# EAGLE design lcduino (EAGLE 6.1)
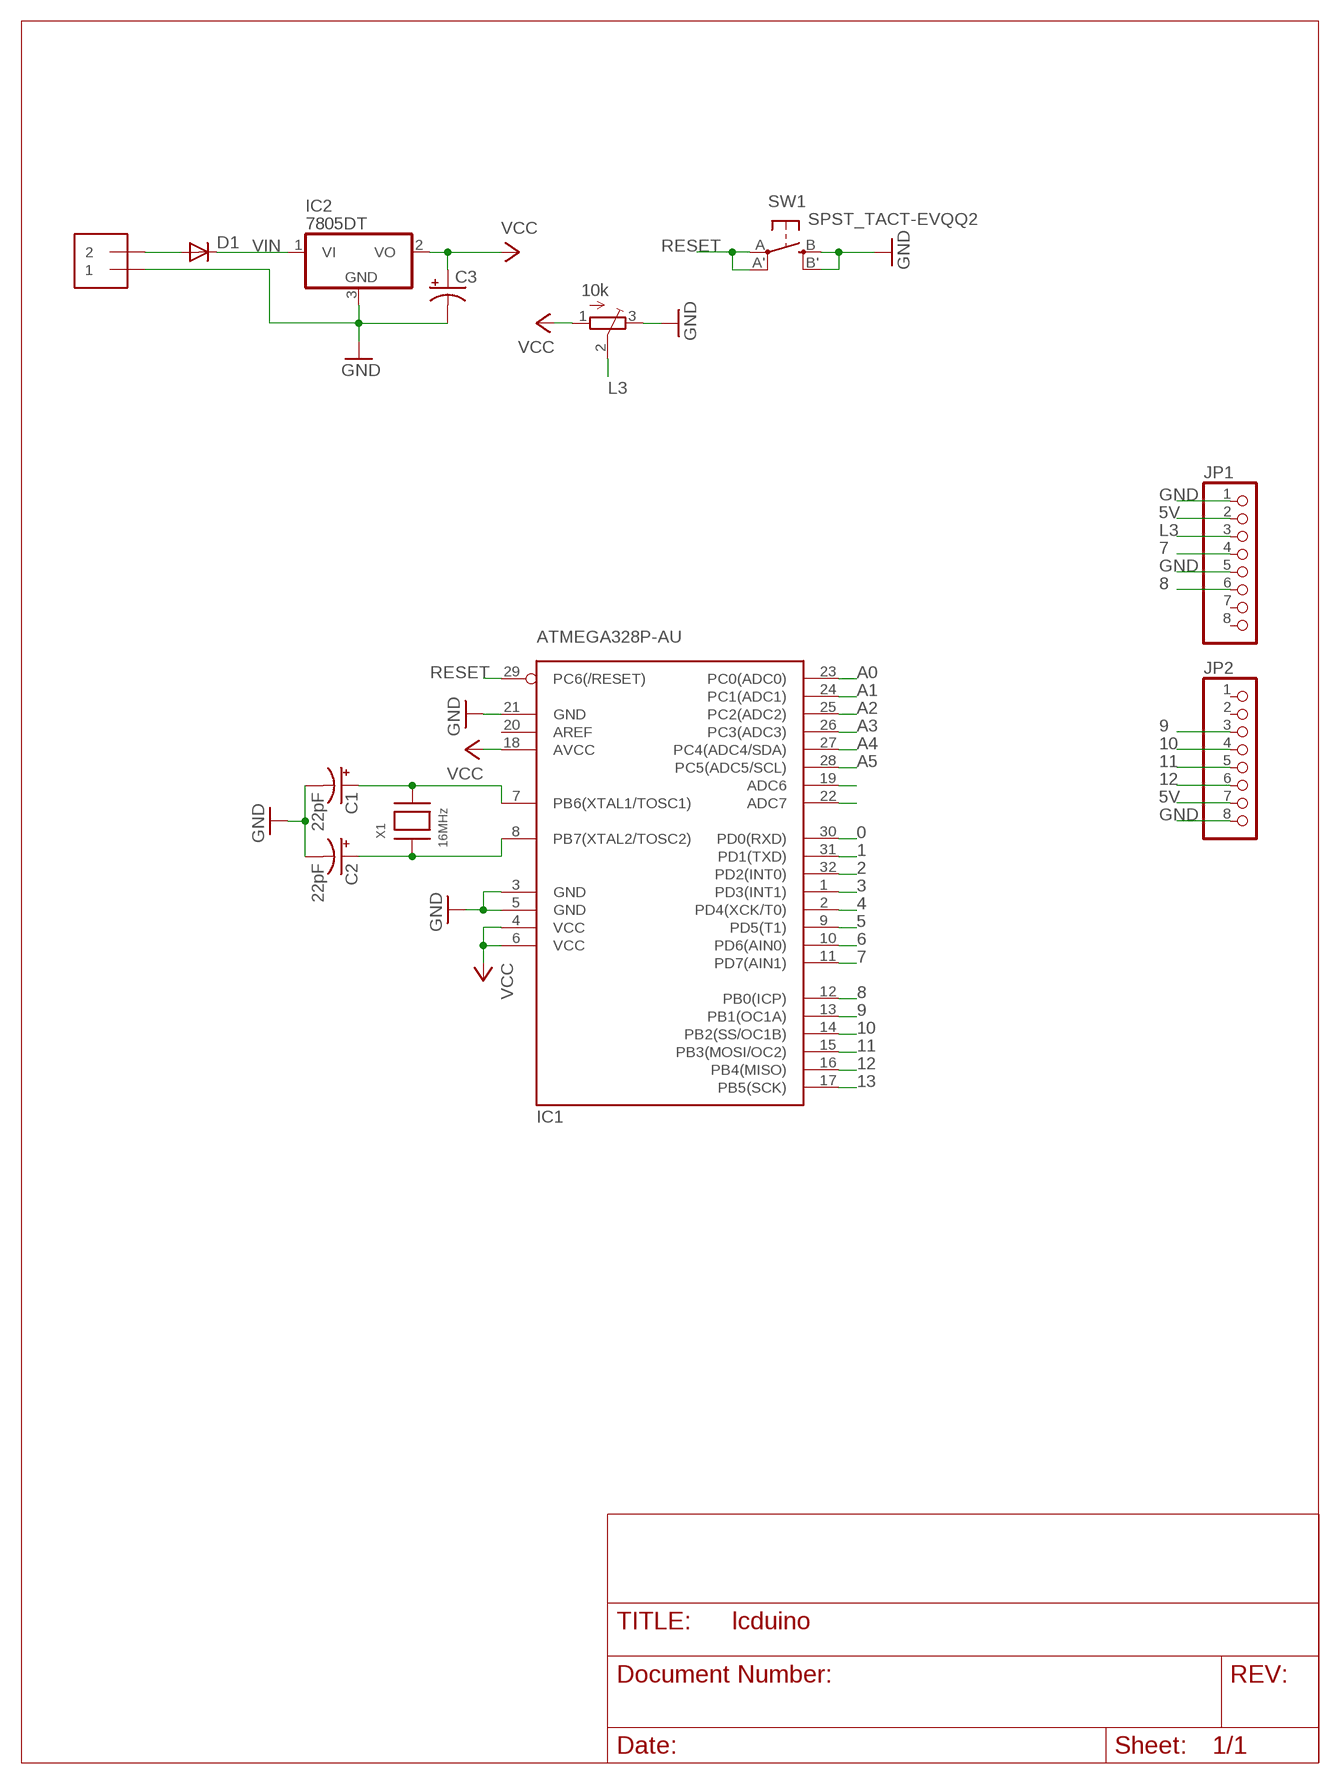
[diagram p0: schematic, sheet 1]

## Parts
C1  22pF  CPOL-US085CS-1AR  [085CS_1AR]
C2  22pF  CPOL-US085CS-1AR  [085CS_1AR]
C3  CPOL-US085CS-1AR  [085CS_1AR]
D1  DIODE-SOD106-R  [SOD106-R]
IC1  MEGA8-AI  [TQFP32-08]
IC2  7805DT  [TO252]
J1  1X2-3.5MM  [1X2-3.5MM]
JP1  PINHD-1X8CLEANBIG  [1X08-CLEANBIG]
JP2  PINHD-1X8CLEANBIG  [1X08-CLEANBIG]
SW1  SPST_TACT-EVQQ2  [EVQ-Q2]
U$1  10k  TRIMPOTTC33X  [TC33X]
X1  16MHz  XTALNX8045  [NX8045]

## Nets
0: IC1.30(PD0(RXD))
1: IC1.31(PD1(TXD))
2: IC1.32(PD2(INT0))
3: IC1.1(PD3(INT1))
4: IC1.2(PD4(XCK/T0))
5: IC1.9(PD5(T1))
5V: C3.+ IC1.4(VCC) IC1.6(VCC) IC1.18(AVCC) IC2.2(VO) JP1.2 JP2.7 U$1.1(A) ; supply symbol labelled VCC
6: IC1.10(PD6(AIN0))
7: IC1.11(PD7(AIN1)) JP1.4
8: IC1.12(PB0(ICP)) JP1.6
9: IC1.13(PB1(OC1A)) JP2.3
10: IC1.14(PB2(SS/OC1B)) JP2.4
11: IC1.15(PB3(MOSI/OC2)) JP2.5
12: IC1.16(PB4(MISO)) JP2.6
13: IC1.17(PB5(SCK))
A0: IC1.23(PC0(ADC0))
A1: IC1.24(PC1(ADC1))
A2: IC1.25(PC2(ADC2))
A3: IC1.26(PC3(ADC3))
A4: IC1.27(PC4(ADC4/SDA))
A5: IC1.28(PC5(ADC5/SCL))
GND: C1.- C2.- C3.- IC1.3(GND) IC1.5(GND) IC1.21(GND) IC2.3(GND) J1.1 JP1.1 JP1.5 JP2.8 SW1.B'(S1) SW1.B(S) U$1.3(E)
L3: JP1.3 U$1.2(S)
N$9: IC1.19(ADC6)
N$10: IC1.22(ADC7)
PWRIN: D1.A J1.2
RESET: IC1.29(PC6(/RESET)) SW1.A'(P1) SW1.A(P)
VIN: D1.C IC2.1(VI)
XTAL1: C1.+ IC1.7(PB6(XTAL1/TOSC1)) X1.P$2
XTAL2: C2.+ IC1.8(PB7(XTAL2/TOSC2)) X1.P$1
Unconnected: IC1.20(AREF) JP1.7 JP1.8 JP2.1 JP2.2

## Library data of the parts
C1-C3 = rcl:CPOL-US: POLARIZED CAPACITOR, American symbol
D1 = diode:DIODE-: DIODE
IC1 = atmel:MEGA8: MICROCONTROLLER 8 Kbytes FLASH, 1 kbytes SRAM, 512 bytes EEPROM, USART, 6-channel 10 bit ADC, 2-channel 8 bit ADC Pin compatible with Atmega48, ATMega88, ATMega168 Source: avr.lbr; MF: Atmel; MPN: ATMEGA328P-AU; OC_FARNELL: 1715486; OC_NEWARK: 68T2935
IC2 = linear:78*: Positive VOLTAGE REGULATOR Source: http://cache.national.com/ds/LM/LM78L05.pdf http://www.fairchildsemi.com/ds/LM/LM7805.pdf
J1 = adafruit:1X2: 3.5mm Terminal block http://www.ladyada.net/library/pcb/eaglelibrary.html
JP1 JP2 = adafruit:PINHD-1X8: PIN HEADER
SW1 = adafruit:SPST_TACT: SMT 6mm switch, EVQQ2 series http://www.ladyada.net/library/eagle
U$1 = adafruit:TRIMPOT: SMT trimmer potentiometer part number TC33X http://www.ladyada.net/library/eagle
X1 = adafruit:XTAL: Low cost SMT crystals, no capacitors included http://www.ladyada.net/library/eagle

## Board
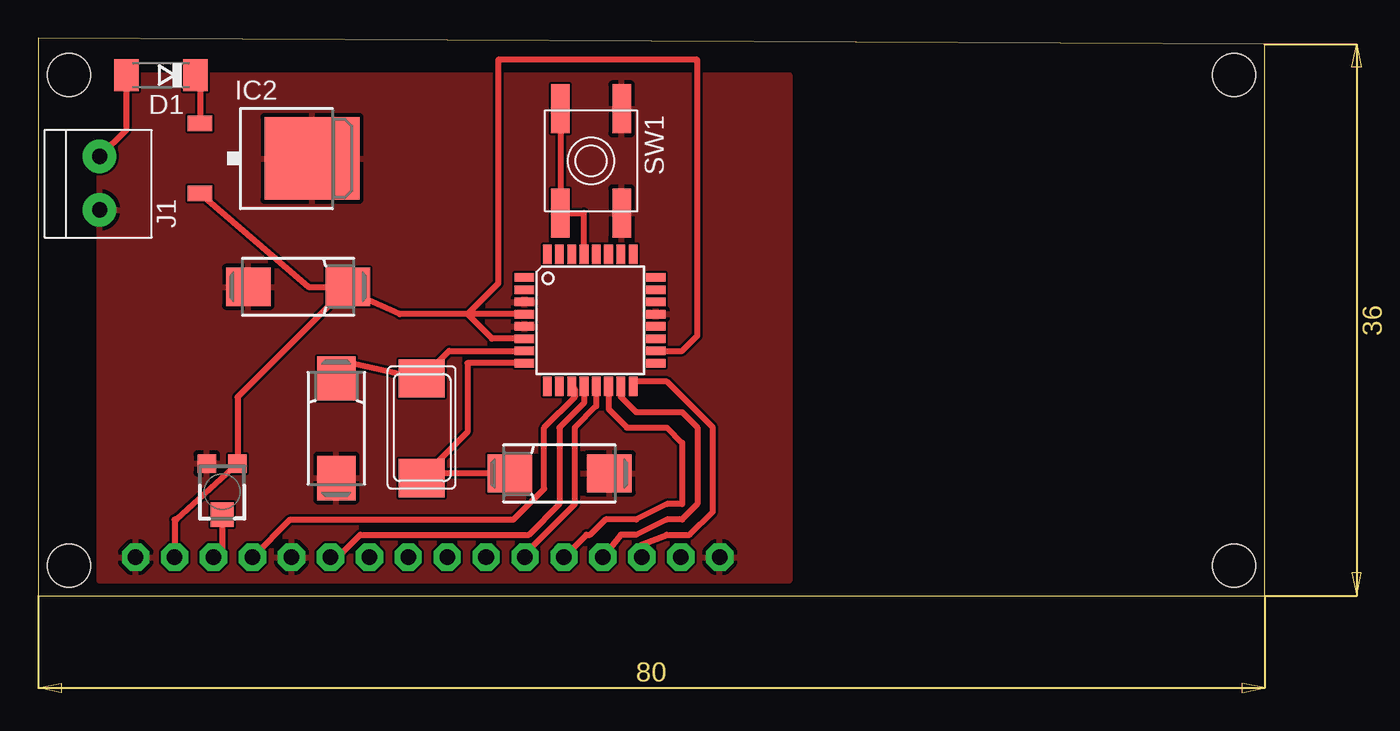
[diagram p1: board, top side]
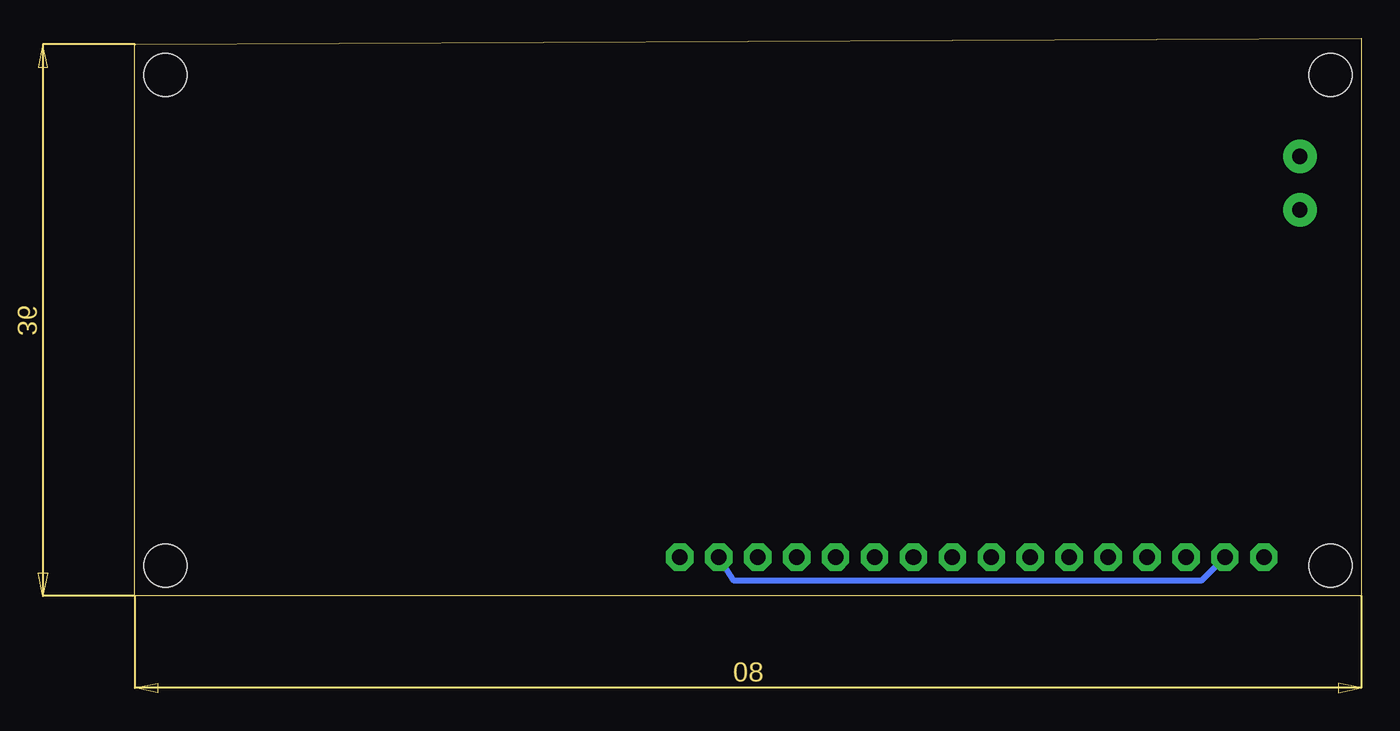
[diagram p2: board, bottom side, seen from below]

Size 80 x 36.4 mm. Coordinates in mm from the lower left corner, seen from the top.
Outline: 0,0 80,0 80,36 0,36.4 0,0
Copper layers (1*16): Top 0.0356mm / dielectric 1.5011mm / Bottom 0.0356mm
Design rules: minimum track width 6mil, minimum drill 13mil, track to track 6mil, track to pad 6mil, pad to pad 6mil, via to via 6mil, smd to smd 6mil, copper to edge 15mil, drill to drill 6mil, minimum pad ring 7mil, minimum via ring 7mil, stop-mask expansion 4mil, vias tented up to drill 0mil, thermal gap 10mil
Holes 2.8 mm at 2,34 78,34 78,2 2,2

### Footprints (pad centres in the part's own frame; a part is rotated, then mirrored left to right if it is on the bottom)
085CS_1AR = smd 2.9 x 2.5: + 3.25,0; - -3.25,0
SOD106-R = smd 1.6 x 2.1: A 2.25,0; C -2.25,0
TQFP32-08 = smd 1.27 x 0.559: 1 -4.293,2.8; 2 -4.293,2; 3 -4.293,1.2; 4 -4.293,0.4; 5 -4.293,-0.4; 6 -4.293,-1.2; 7 -4.293,-2; 8 -4.293,-2.8; 17 4.293,-2.8; 18 4.293,-2; 19 4.293,-1.2; 20 4.293,-0.4; 21 4.293,0.4; 22 4.293,1.2; 23 4.293,2; 24 4.293,2.8 | smd 0.559 x 1.27: 9 -2.8,-4.293; 10 -2,-4.293; 11 -1.2,-4.293; 12 -0.4,-4.293; 13 0.4,-4.293; 14 1.2,-4.293; 15 2,-4.293; 16 2.8,-4.293; 25 2.8,4.293; 26 2,4.293; 27 1.2,4.293; 28 0.4,4.293; 29 -0.4,4.293; 30 -1.2,4.293; 31 -2,4.293; 32 -2.8,4.293
TO252 = smd 1 x 1.6: 1 -2.28,-4.8; 2 2.28,-4.8 | smd 5.4 x 6.2: 3 0,2.5
1X2-3.5MM = drill 1 pad 2.184: 1 1.8,0; 2 -1.7,0
1X08-CLEANBIG = drill 1.016 pad 1.778 octagon: 1 -8.89,0; 2 -6.35,0; 3 -3.81,0; 4 -1.27,0; 5 1.27,0; 6 3.81,0; 7 6.35,0; 8 8.89,0
EVQ-Q2 = smd 3.2 x 1.2: A -3.4,-2; A' 3.4,-2; B -3.4,2; B' 3.4,2
TC33X = smd 1.2 x 1.2: 1 -1,-1.825; 3 1,-1.825 | smd 1.5 x 1.6: 2 0,1.5
NX8045 = smd 2.5 x 3: P$1 3.3,0; P$2 -3.2,0

### Placement (x,y rotation side)
C1  19.44,10.95 90 top
C2  34,8 180 top
C3  16.95,20.18 0 top
D1  8,34 180 top
IC1  36,18 0 top
IC2  15.35,28.56 270 top
J1  4,27 270 top
JP1  15.24,2.54 0 top
JP2  35.56,2.54 0 top
SW1  36.06,28.4 270 top
U$1  11.99,6.82 180 top
X1  25,11 270 top

### Tracks (layer width: path | path; a pad name or v marks a point on that pad's centre or on a via)
5V
  Top 0.406: JP1.2 8.89,5 9,5 U$1.1 12.99,12.99 20,20 | IC2.2 17.65,20.18 C3.+ 20.18,20.18 20,20 | IC1.4 28,18.4 | 28,18.4 23.6,18.4 20,20 | IC1.6 29.6,16.8 28,18.4 | IC1.18 42,16 43,17 43,35 30,35 30,20.4 28,18.4
  Bottom 0.406: JP1.2 10.43,1 40.91,1 JP2.7
7
  Top 0.406: JP1.4 16.43,5 31,5 33,7 33,11 35,13 35,13.51 IC1.11
8
  Top 0.406: JP1.6 19.54,2.54 21,4 32,4 34,6 34,11 35.6,12.6 IC1.12
9
  Top 0.406: JP2.3 31.75,2.75 35,6 35,11 36.4,12.4 IC1.13
10
  Top 0.406: IC1.14 37.2,12.2 38.4,11 41,11 42,10 42,6 41,6 39,5 37,5 36,4 35.75,4 JP2.4
11
  Top 0.406: IC1.15 38,13 39,12 42,12 43,11 43,6 42,5 41,5 39,4 38,4 JP2.5
12
  Top 0.406: JP2.6 39.37,3.37 41,4 42.49,4 44,5.51 44,11 41,14 39,14 38.8,13.8 IC1.16
GND
  pour Top: 4,34 49,34 49,1 4,1
L3
  Top 0.406: U$1.2 11.99,3.1 JP1.3
PWRIN
  Top 0.406: J1.2 5.75,30.45 D1.A
RESET
  Top 0.406: IC1.29 35.6,25 SW1.A' 34,25 34,26 34.06,26 SW1.A
VIN
  Top 0.406: D1.C 10.55,33.7 IC2.1
XTAL1
  Top 0.406: C1.+ 20.44,15.2 X1.P$2 26.8,16 IC1.7 32,16
XTAL2
  Top 0.406: IC1.8 28,15.2 28,10.7 X1.P$1 26,8 C2.+